# Altium schematic sheet ServoExpanderPCB.SchDoc
size A4; SheetNumber: 1; SheetTotal: 1; SPICEModelCacheKVOWIFCI: <root> / <DocumentId>KVOWIFCI</DocumentId> / <CacheFrame Number="0"> / <Model Name="diode" Kind="MDL"> / <Text>*Default Diode / *Diode Pinout: A,K / .MODEL DIODE D()</Text> / </Model> / <Model Name="cap" Kind="MDL"> / <Text>*Default semiconductor capacitor / .MODEL CAP C()</Text> / </Model> / </CacheFrame> / </root>
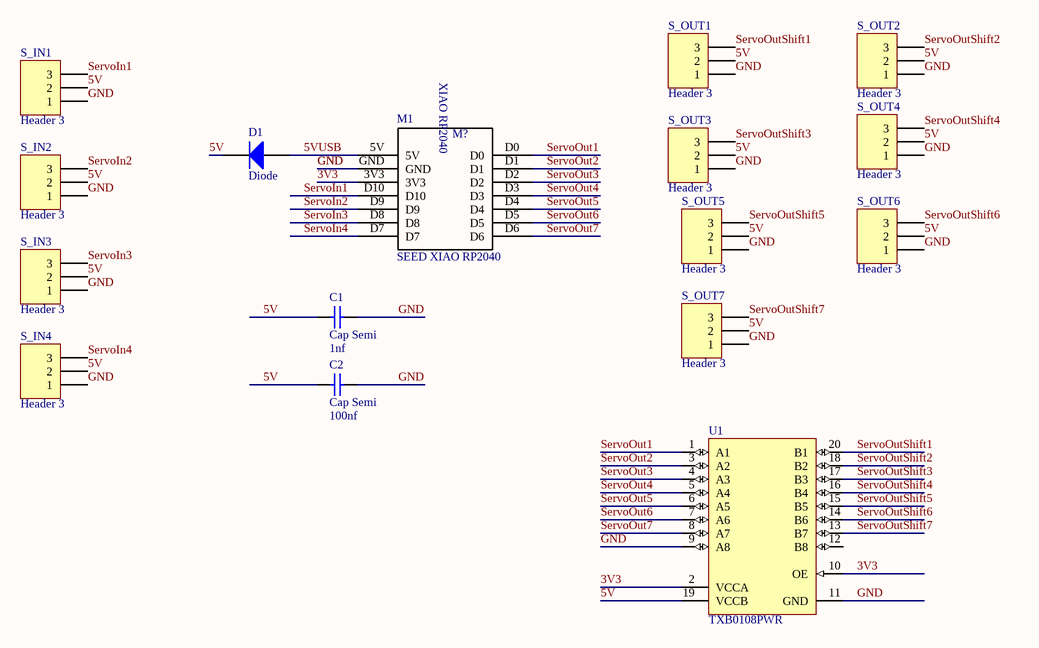
[diagram p0: ServoExpanderPCB.SchDoc]

## Parts
C1  Cap Semi  value 1nf  [6-0805_M]
C2  Cap Semi  value 100nf  [6-0805_M]
D1  Diode  [6-0805_M]
M1  SEED XIAO RP2040  [XIAO RP2040]
S_IN1  Header 3  [HDR1X3]
S_IN2  Header 3  [HDR1X3]
S_IN3  Header 3  [HDR1X3]
S_IN4  Header 3  [HDR1X3]
S_OUT1  Header 3  [HDR1X3]
S_OUT2  Header 3  [HDR1X3]
S_OUT3  Header 3  [HDR1X3]
S_OUT4  Header 3  [HDR1X3]
S_OUT5  Header 3  [HDR1X3]
S_OUT6  Header 3  [HDR1X3]
S_OUT7  Header 3  [HDR1X3]
U1  TXB0108PWR  [PW0020A_L]

## Nets
3V3: M1.3V3 U1.2(VCCA) U1.10(OE)
5V: C1.1 C2.1 D1.2(K) S_IN1.2 S_IN2.2 S_IN3.2 S_IN4.2 S_OUT1.2 S_OUT2.2 S_OUT3.2 S_OUT4.2 S_OUT5.2 S_OUT6.2 S_OUT7.2 U1.19(VCCB)
5VUSB: D1.1(A) M1.5V
GND: C1.2 C2.2 M1.GND S_IN1.1 S_IN2.1 S_IN3.1 S_IN4.1 S_OUT1.1 S_OUT2.1 S_OUT3.1 S_OUT4.1 S_OUT5.1 S_OUT6.1 S_OUT7.1 U1.9(A8) U1.11(GND)
ServoIn1: M1.D10 S_IN1.3
ServoIn2: M1.D9 S_IN2.3
ServoIn3: M1.D8 S_IN3.3
ServoIn4: M1.D7 S_IN4.3
ServoOut1: M1.D0 U1.1(A1)
ServoOut2: M1.D1 U1.3(A2)
ServoOut3: M1.D2 U1.4(A3)
ServoOut4: M1.D3 U1.5(A4)
ServoOut5: M1.D4 U1.6(A5)
ServoOut6: M1.D5 U1.7(A6)
ServoOut7: M1.D6 U1.8(A7)
ServoOutShift1: S_OUT1.3 U1.20(B1)
ServoOutShift2: S_OUT2.3 U1.18(B2)
ServoOutShift3: S_OUT3.3 U1.17(B3)
ServoOutShift4: S_OUT4.3 U1.16(B4)
ServoOutShift5: S_OUT5.3 U1.15(B5)
ServoOutShift6: S_OUT6.3 U1.14(B6)
ServoOutShift7: S_OUT7.3 U1.13(B7)

Not connected (* = marked no-connect by the designer): U1 12(B8)

## Notes on the sheet
- (in symbol SEED XIAO RP2040) M?; XIAO RP2040

## Library data of the parts
C1 C2 = Cap Semi: Capacitor (Semiconductor SIM Model); Published: 8-Jun-2000; LatestRevisionDate: 29-May-2009; LatestRevisionNote: IPC-7351 Footprint Added.; PackageReference: C1206; Publisher: Altium Limited; PackageDescription: Chip Capacitor
D1 = Diode: Default Diode; Published: 8-Jun-2000; LatestRevisionDate: 17-Jul-2002; LatestRevisionNote: Re-released for DXP Platform.; PackageVersion: Sep-1996; PackageReference: SMC; Publisher: Altium Limited; PackageDescription: DO-214-AB/SMC; 2 C-Bend Leads; Body 7.9 x 5.9 mm, inc. leads (LxW); Code_JEDEC: DO-214-AB
S_IN1-S_IN4 S_OUT1-S_OUT7 = Header 3: Header, 3-Pin; LatestRevisionDate: 17-Jul-2002; LatestRevisionNote: Re-released for DXP Platform.; Publisher: Altium Limited
U1 = CMP-2000-07337-1: TXB0108 8-Bit Bidirectional Voltage-Level Translator with Auto-Direction Sensing and / +/- 15-kV ESD Protection, 1.2 to 3.6 V, -40 to 85 degC, 20-Pin TSSOP (PW), Green (RoHS & no Sb/Br), Tape and Reel; Manufacturer: Texas Instruments; Propagation Delay (Max): 4ns; Logic Function: Translator,Bidirectional; Input Type: Logic; Package Version: 4040064-5/G, 02/2011; Voltage - Supply: 1.2V~3.6V,1.65V~5.5V; Data Rate: 100Mbps; Other Names: 296-21527-6; Number of Channels: 8; Differential - Input: Output:No/No; Number of Outputs/Channel: 1; Product Training Modules: VoltageLevelTranslation; Dynamic Catalog: TXBSeries; Package Reference: PW20; Package Description: 20-Pin Small Outline Package Integrated Circuit, Body 6.5 x 4.4 mm, Pitch 0.65 mm; Category: IntegratedCircuits(ICs); Datasheet URL: http://www.ti.com/general/docs/lit/getliterature.tsp?genericPartNumber=TXB0108&fileType=pdf; Package / Case: 20-TSSOP(0.173",4.40mmWidth); Family: Logic-Translators; Standard Package: 1; Series: -; Manufacturer URL: http://www.ti.com/; Number of Bits: 8; Package URL: http://www.ti.com/litv/pdf/mpds362; Output Type: Logic; Datasheet Version: Rev. F, 12/2014; Packaging: Digi-Reel®; Operating Temperature: -40°C~85°C; Supplier Device Package: 20-TSSOP; Mounting Technology: SurfaceMount